# Altium schematic sheet BOARD_CONNECTOR_1x.SchDoc
size B
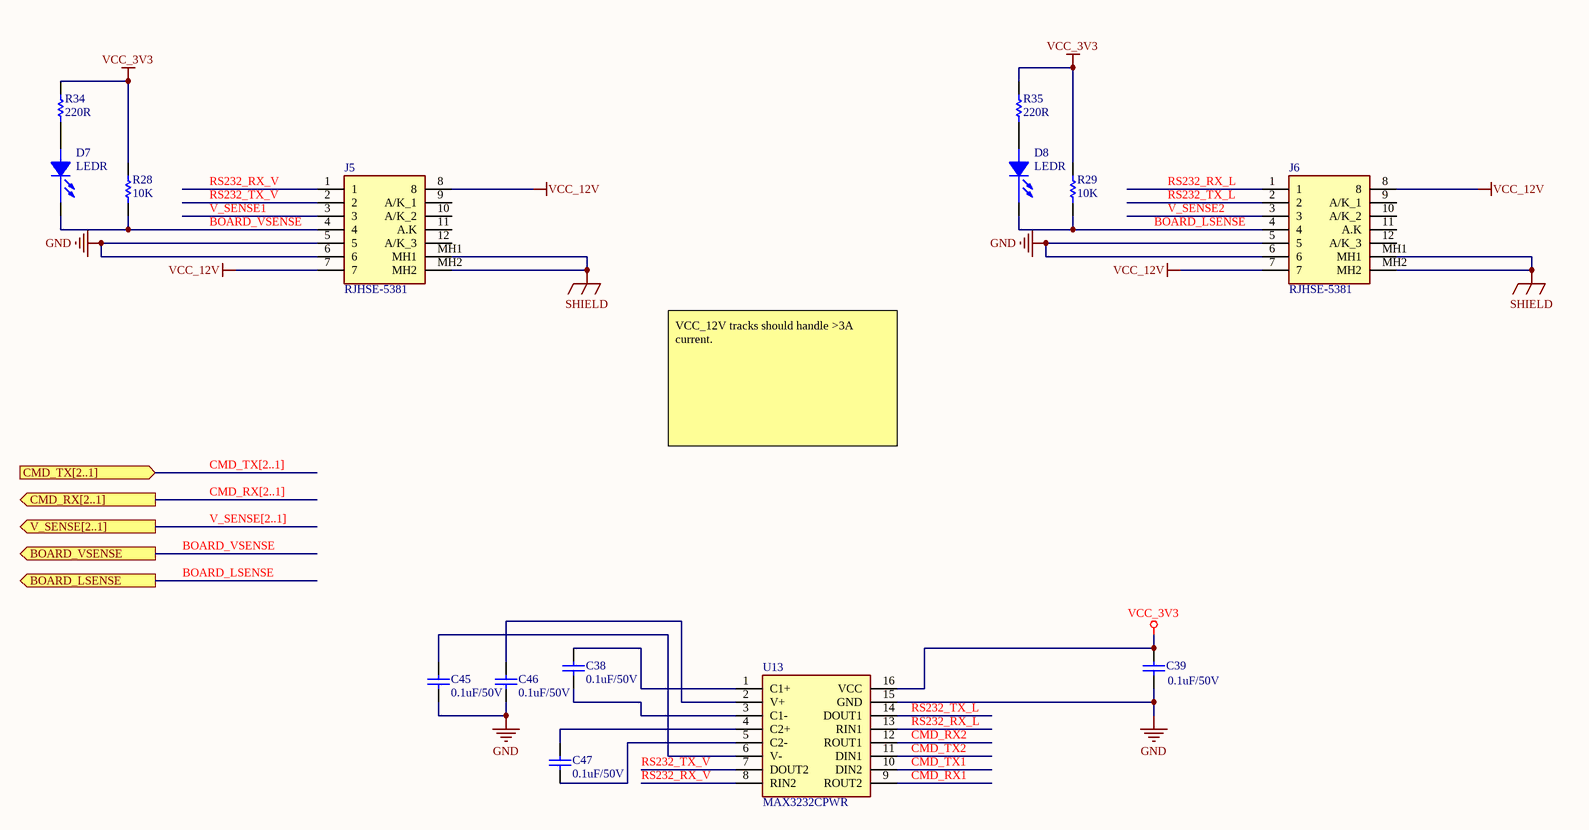
[diagram p0: BOARD_CONNECTOR_1x.SchDoc]

## Parts
C38  0.1uF/50V  [0603C]
C39  0.1uF/50V  [0603C]
C45  0.1uF/50V  [0603C]
C46  0.1uF/50V  [0603C]
C47  0.1uF/50V  [0603C]
D7  LEDR  [LED_0603]
D8  LEDR  [LED_0603]
J5  RJHSE-5381  [RJHSE5381]
J6  RJHSE-5381  [RJHSE5381]
R28  10K  [0603R]
R29  10K  [0603R]
R34  220R  [0603R]
R35  220R  [0603R]
U13  MAX3232CPWR  [MAX3232CPWR]

## Ports
BOARD_LSENSE (out), BOARD_VSENSE (out), CMD_RX[2..1] (out), CMD_TX[2..1] (in), V_SENSE[2..1] (out)

## Nets
GND: C39.1 C45.1 C46.1 J5.5 J5.6 J6.5 J6.6 U13.15(GND)
SHIELD: J5.MH1 J5.MH2 J6.MH1 J6.MH2
VCC_3V3: C39.2 R28.1 R29.1 R34.2 R35.2 U13.16(VCC)
VCC_12V: J5.7 J5.8 J6.7 J6.8
BOARD_LSENSE: D8.2(CATHODE) J6.4 R29.2 ; port BOARD_LSENSE
BOARD_VSENSE: D7.2(CATHODE) J5.4 R28.2 ; port BOARD_VSENSE
CMD_RX1: U13.9(ROUT2)
CMD_RX2: U13.12(ROUT1)
CMD_TX1: U13.10(DIN2)
CMD_TX2: U13.11(DIN1)
RS232_RX_L: J6.1 U13.13(RIN1)
RS232_RX_V: J5.1 U13.8(RIN2)
RS232_TX_L: J6.2 U13.14(DOUT1)
RS232_TX_V: J5.2 U13.7(DOUT2)
V_SENSE1: J5.3
V_SENSE2: J6.3
NetC38_1: C38.1 U13.3(C1-)
NetC38_2: C38.2 U13.1(C1+)
NetC45_2: C45.2 U13.6(V-)
NetC46_2: C46.2 U13.2(V+)
NetC47_1: C47.1 U13.5(C2-)
NetC47_2: C47.2 U13.4(C2+)
NetD7_1: D7.1(ANODE) R34.1
NetD8_1: D8.1(ANODE) R35.1

Not connected (* = marked no-connect by the designer): J5 9(A/K_1) 10(A/K_2) 11(A.K) 12(A/K_3); J6 9(A/K_1) 10(A/K_2) 11(A.K) 12(A/K_3)

## Buses and harness runs
bus CMD_RX[2..1] = port CMD_RX[2..1]
bus CMD_TX[2..1] = port CMD_TX[2..1]
bus V_SENSE[2..1] = port V_SENSE[2..1]

## Notes on the sheet
- VCC_12V tracks should handle >3A current.

## Library data of the parts
C38 C39 C45-C47 = Cap: Multilayer Ceramic Capacitors MLCC - SMD/SMT 50V 0.1uF 0603 X7R 20%; Mfr: KEMET; Mfr Part No: C0603C104M5RACTU; Package: 0603; Price: 0.101; Stockiest: MOUSER; Stockiest Part No: 80-C0603C104M5R; Value: 0.1uF/50V
D7 D8 = LED: Standard LEDs - SMD Red 631nm 14mcd 5mA; Mfr: Lite On; Mfr Part No: LTST-C193KRKT-5A; Package: 0603; Price: 0.28; Stockiest: MOUSER; Stockiest Part No: 859-LTSTC193KRKT5A; Value: RED
J5 J6 = RJHSE-5381: Modular Connectors / Ethernet Connectors R/A RJ45 SHEILDED 8 CONT Y/G LEDS; Mfr: Amphenol Commercial Products; Mfr Part No: RJHSE-5381; Price: 1.77; Stockiest: MOUSER; Stockiest Part No: 523-RJHSE-5381
R28 R29 = Res1: Thick Film Resistors - SMD 0603 10Kohms 1% Anti-Sulfur AEC-Q200; Mfr: ROHM Semiconductor; Mfr Part No: SFR03EZPF1002; Value: 10K; Package: 0603; Price: 0.101; Stockiest: MOUSER; Stockiest Part No: 755-SFR03EZPF1002
R34 R35 = Res1: Thick Film Resistors - SMD 1/10Watt 220ohms 5% Commercial Use; Mfr: Vishay / Dale; Mfr Part No: CRCW0603220RJNEAC; Package: 0603; Price: 0.101; Stockiest: MOUSER; Stockiest Part No: 71-CRCW0603220RJNEAC; Value: 220R
U13 = MAX3232CPWR: RS-232 Interface IC 3-5.5V Mult-Ch RS232; Mfr: Texas Instruments; Mfr Part No: MAX3232CPWR; Price: 0.94; Stockiest: MOUSER; Stockiest Part No: 595-MAX3232CPWR